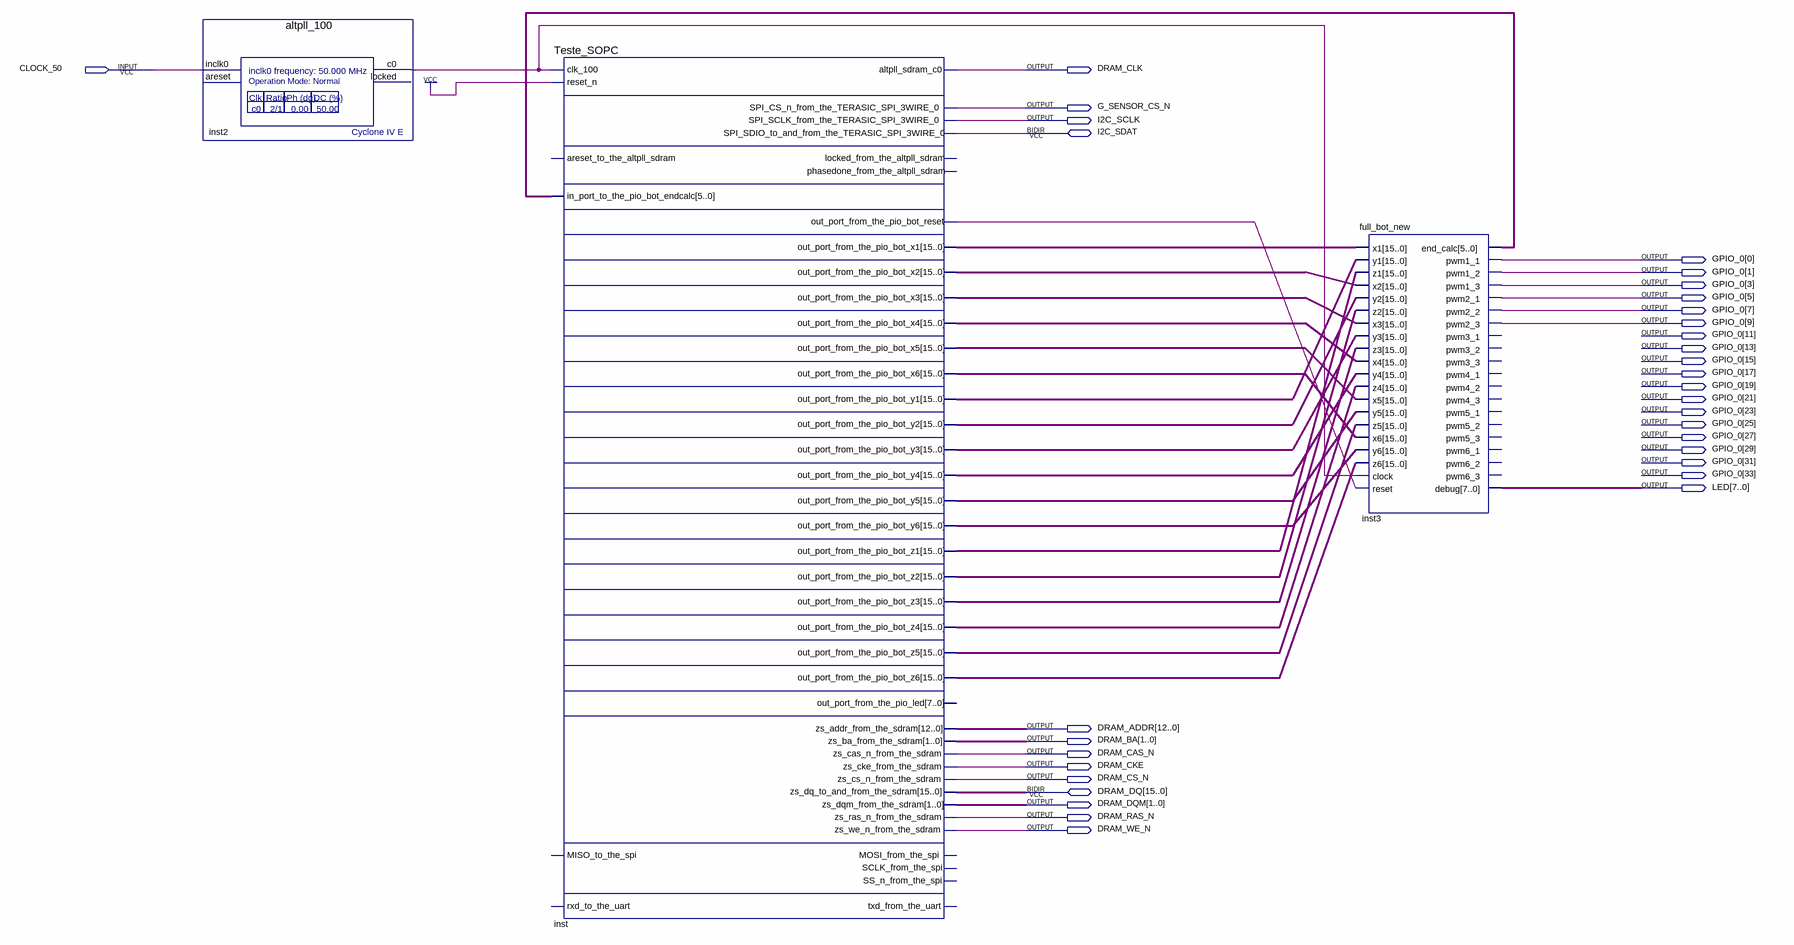
[diagram p0: schematic sheet]
// Quartus schematic TesteNIOS_2_2roms.bdf as structural Verilog: 3 symbols, 33 pins
module TesteNIOS_2_2roms (
  input  CLOCK_50,
  inout  I2C_SDAT,
  inout  [15:0] DRAM_DQ,
  output DRAM_CLK,
  output G_SENSOR_CS_N,
  output I2C_SCLK,
  output [33:0] GPIO_0,
  output [7:0] LED,
  output [12:0] DRAM_ADDR,
  output [1:0] DRAM_BA,
  output DRAM_CAS_N,
  output DRAM_CKE,
  output DRAM_CS_N,
  output [1:0] DRAM_DQM,
  output DRAM_RAS_N,
  output DRAM_WE_N
);

  wire inst2_c0, inst_out_port_from_the_pio_bot_reset;
  wire [5:0] inst3_end_calc;
  wire [15:0] inst_out_port_from_the_pio_bot_x1, inst_out_port_from_the_pio_bot_x2,
       inst_out_port_from_the_pio_bot_x3, inst_out_port_from_the_pio_bot_x4,
       inst_out_port_from_the_pio_bot_x5, inst_out_port_from_the_pio_bot_x6,
       inst_out_port_from_the_pio_bot_y1, inst_out_port_from_the_pio_bot_y2,
       inst_out_port_from_the_pio_bot_y3, inst_out_port_from_the_pio_bot_y4,
       inst_out_port_from_the_pio_bot_y5, inst_out_port_from_the_pio_bot_y6,
       inst_out_port_from_the_pio_bot_z1, inst_out_port_from_the_pio_bot_z2,
       inst_out_port_from_the_pio_bot_z3, inst_out_port_from_the_pio_bot_z4,
       inst_out_port_from_the_pio_bot_z5, inst_out_port_from_the_pio_bot_z6;

  altpll_100 inst2 (.inclk0(CLOCK_50), .c0(inst2_c0));  // open: areset, locked
  Teste_SOPC inst (
    .clk_100(inst2_c0), .reset_n(1'b1), .in_port_to_the_pio_bot_endcalc(inst3_end_calc),
    .altpll_sdram_c0(DRAM_CLK), .SPI_CS_n_from_the_TERASIC_SPI_3WIRE_0(G_SENSOR_CS_N),
    .SPI_SCLK_from_the_TERASIC_SPI_3WIRE_0(I2C_SCLK),
    .out_port_from_the_pio_bot_reset(inst_out_port_from_the_pio_bot_reset),
    .out_port_from_the_pio_bot_x1(inst_out_port_from_the_pio_bot_x1),
    .out_port_from_the_pio_bot_x2(inst_out_port_from_the_pio_bot_x2),
    .out_port_from_the_pio_bot_x3(inst_out_port_from_the_pio_bot_x3),
    .out_port_from_the_pio_bot_x4(inst_out_port_from_the_pio_bot_x4),
    .out_port_from_the_pio_bot_x5(inst_out_port_from_the_pio_bot_x5),
    .out_port_from_the_pio_bot_x6(inst_out_port_from_the_pio_bot_x6),
    .out_port_from_the_pio_bot_y1(inst_out_port_from_the_pio_bot_y1),
    .out_port_from_the_pio_bot_y2(inst_out_port_from_the_pio_bot_y2),
    .out_port_from_the_pio_bot_y3(inst_out_port_from_the_pio_bot_y3),
    .out_port_from_the_pio_bot_y4(inst_out_port_from_the_pio_bot_y4),
    .out_port_from_the_pio_bot_y5(inst_out_port_from_the_pio_bot_y5),
    .out_port_from_the_pio_bot_y6(inst_out_port_from_the_pio_bot_y6),
    .out_port_from_the_pio_bot_z1(inst_out_port_from_the_pio_bot_z1),
    .out_port_from_the_pio_bot_z2(inst_out_port_from_the_pio_bot_z2),
    .out_port_from_the_pio_bot_z3(inst_out_port_from_the_pio_bot_z3),
    .out_port_from_the_pio_bot_z4(inst_out_port_from_the_pio_bot_z4),
    .out_port_from_the_pio_bot_z5(inst_out_port_from_the_pio_bot_z5),
    .out_port_from_the_pio_bot_z6(inst_out_port_from_the_pio_bot_z6), .zs_addr_from_the_sdram(DRAM_ADDR),
    .zs_ba_from_the_sdram(DRAM_BA), .zs_cas_n_from_the_sdram(DRAM_CAS_N), .zs_cke_from_the_sdram(DRAM_CKE),
    .zs_cs_n_from_the_sdram(DRAM_CS_N), .zs_dqm_from_the_sdram(DRAM_DQM),
    .zs_ras_n_from_the_sdram(DRAM_RAS_N), .zs_we_n_from_the_sdram(DRAM_WE_N),
    .SPI_SDIO_to_and_from_the_TERASIC_SPI_3WIRE_0(I2C_SDAT), .zs_dq_to_and_from_the_sdram(DRAM_DQ));  // open: areset_to_the_altpll_sdram, MISO_to_the_spi, rxd_to_the_uart, locked_from_the_altpll_sdram, phasedone_from_the_altpll_sdram, out_port_from_the_pio_led, MOSI_from_the_spi, SCLK_from_the_spi, SS_n_from_the_spi, txd_from_the_uart
  full_bot_new inst3 (
    .x1(inst_out_port_from_the_pio_bot_x1), .y1(inst_out_port_from_the_pio_bot_y1),
    .z1(inst_out_port_from_the_pio_bot_z1), .x2(inst_out_port_from_the_pio_bot_x2),
    .y2(inst_out_port_from_the_pio_bot_y2), .z2(inst_out_port_from_the_pio_bot_z2),
    .x3(inst_out_port_from_the_pio_bot_x3), .y3(inst_out_port_from_the_pio_bot_y3),
    .z3(inst_out_port_from_the_pio_bot_z3), .x4(inst_out_port_from_the_pio_bot_x4),
    .y4(inst_out_port_from_the_pio_bot_y4), .z4(inst_out_port_from_the_pio_bot_z4),
    .x5(inst_out_port_from_the_pio_bot_x5), .y5(inst_out_port_from_the_pio_bot_y5),
    .z5(inst_out_port_from_the_pio_bot_z5), .x6(inst_out_port_from_the_pio_bot_x6),
    .y6(inst_out_port_from_the_pio_bot_y6), .z6(inst_out_port_from_the_pio_bot_z6), .clock(inst2_c0),
    .reset(inst_out_port_from_the_pio_bot_reset), .end_calc(inst3_end_calc), .pwm1_1(GPIO_0[0]),
    .pwm1_2(GPIO_0[1]), .pwm1_3(GPIO_0[3]), .pwm2_1(GPIO_0[5]), .pwm2_2(GPIO_0[7]), .pwm2_3(GPIO_0[9]),
    .debug(LED));  // open: pwm3_1, pwm3_2, pwm3_3, pwm4_1, pwm4_2, pwm4_3, pwm5_1, pwm5_2, pwm5_3, pwm6_1, pwm6_2, pwm6_3
endmodule
